# Altium project PCB_Project_v6.PrjPcb
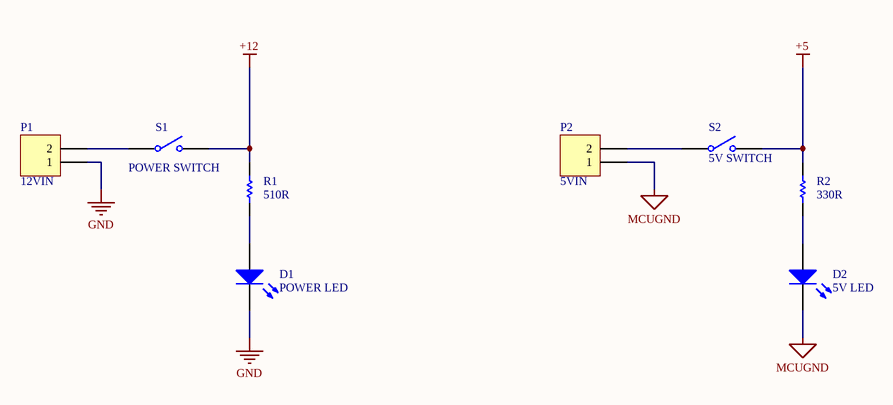
[diagram p0: Main_schematic.SchDoc]
Title: Main Schematic
1 sheet, 8 parts. Net scope: global (net labels, ports and power ports of the same name join across sheets).
Board file: H_bridge_PCB.PcbDoc

## Sheet Main_schematic.SchDoc: PowerSupply
size A4; DocumentNumber: 2; Revision: v1; SheetNumber: 2; SheetTotal: 4

### Parts
D1  POWER LED  [LED-1]
D2  5V LED  [LED-1]
P1  12VIN  [HDR1X2]
P2  5VIN  [HDR1X2]
R1  value 510R  [AXIAL-0.3]  (hidden comment: Res1)
R2  value 330R  [AXIAL-0.3]  (hidden comment: Res1)
S1  POWER SWITCH  [SPST-2]
S2  5V SWITCH  [SPST-2]

### Nets
+5: R2.2 S2.2(NO)
+12: R1.2 S1.2(NO)
GND: D1.2(K) P1.1
MCUGND: D2.2(K) P2.1
NetD1_1: D1.1(A) R1.1
NetD2_1: D2.1(A) R2.1
NetP1_2: P1.2 S1.1(COMMON)
NetP2_2: P2.2 S2.1(COMMON)

### Library data of the parts
D1 D2 = LED1: Typical RED GaAs LED; Published: 8-Jun-2000; LatestRevisionDate: 08-Jul-2005; LatestRevisionNote: Mech Layer 1 removed.; PackageReference: LED-1; Publisher: Altium Limited; PackageDescription: LED; 2 Leads
P1 P2 = Header 2: Header, 2-Pin; LatestRevisionDate: 17-Jul-2002; LatestRevisionNote: Re-released for DXP Platform.; Publisher: Altium Limited
R1 R2 = Res1: Resistor; Published: 8-Jun-2000; LatestRevisionDate: 17-Jul-2002; LatestRevisionNote: Re-released for DXP Platform.; PackageReference: AXIAL-0.3; Publisher: Altium Limited; PackageDescription: Axial Device, Thru-Hole; 2 Leads; 0.3 in Pin Spacing
S1 S2 = SW-SPST: Single-Pole, Single-Throw Switch; Published: 24-Mar-1999; LatestRevisionDate: 17-Jul-2002; LatestRevisionNote: Re-released for DXP Platform.; PackageReference: SPST-2; Publisher: Altium Limited; PackageDescription: Switch; 2 Leads